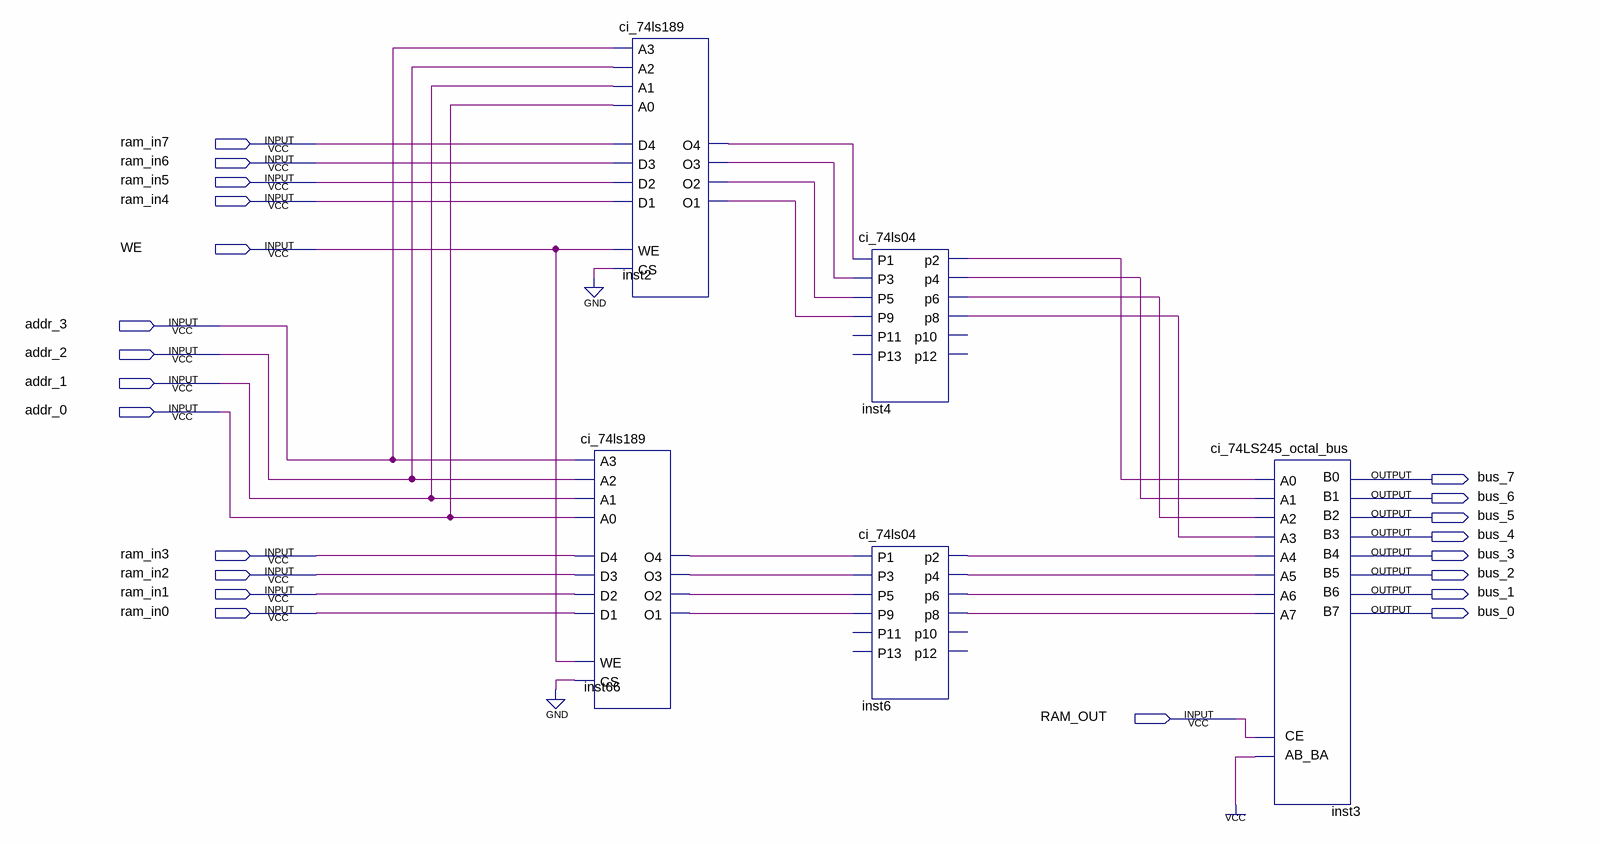
[diagram p0: schematic sheet]
// Quartus schematic cp_memoria_ram.bdf as structural Verilog: 5 symbols, 22 pins
module cp_memoria_ram (
  input  ram_in7,
  input  ram_in6,
  input  ram_in5,
  input  ram_in4,
  input  WE,
  input  addr_3,
  input  addr_2,
  input  addr_1,
  input  addr_0,
  input  ram_in3,
  input  ram_in2,
  input  ram_in1,
  input  ram_in0,
  input  RAM_OUT,
  output bus_7,
  output bus_6,
  output bus_5,
  output bus_4,
  output bus_3,
  output bus_2,
  output bus_1,
  output bus_0
);

  wire inst2_o1, inst2_o2, inst2_o3, inst2_o4, inst4_p2, inst4_p4, inst4_p6, inst4_p8, inst6_p2, inst6_p4,
       inst6_p6, inst6_p8, inst66_o1, inst66_o2, inst66_o3, inst66_o4;

  ci_74ls189 inst2 (
    .A1(addr_1), .A0(addr_0), .A2(addr_2), .A3(addr_3), .CS(1'b0), .D4(ram_in7), .D3(ram_in6), .D2(ram_in5),
    .D1(ram_in4), .WE(WE), .O4(inst2_o4), .O3(inst2_o3), .O2(inst2_o2), .O1(inst2_o1));
  ci_74ls189 inst66 (
    .A1(addr_1), .A0(addr_0), .A2(addr_2), .A3(addr_3), .CS(1'b0), .D4(ram_in3), .D3(ram_in2), .D2(ram_in1),
    .D1(ram_in0), .WE(WE), .O4(inst66_o4), .O3(inst66_o3), .O2(inst66_o2), .O1(inst66_o1));
  ci_74ls04 inst4 (
    .P9(inst2_o1), .P1(inst2_o4), .P3(inst2_o3), .P5(inst2_o2), .p8(inst4_p8), .p2(inst4_p2), .p4(inst4_p4),
    .p6(inst4_p6));  // open: P11, P13, p10, p12
  ci_74ls04 inst6 (
    .P9(inst66_o1), .P1(inst66_o4), .P3(inst66_o3), .P5(inst66_o2), .p8(inst6_p8), .p2(inst6_p2),
    .p4(inst6_p4), .p6(inst6_p6));  // open: P11, P13, p10, p12
  ci_74LS245_octal_bus inst3 (
    .CE(RAM_OUT), .AB_BA(1'b1), .B6(bus_1), .B7(bus_0), .B0(bus_7), .B1(bus_6), .B2(bus_5), .B3(bus_4),
    .B4(bus_3), .B5(bus_2), .A0(inst4_p2), .A1(inst4_p4), .A2(inst4_p6), .A3(inst4_p8), .A4(inst6_p2),
    .A5(inst6_p4), .A6(inst6_p6), .A7(inst6_p8));
endmodule
